# EAGLE schematic LEDTestingCircuit (EAGLE 8.3.1)
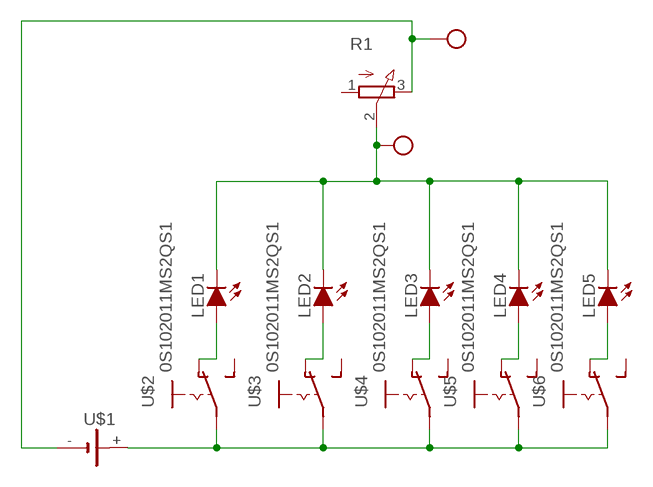
[diagram p0: schematic, sheet 1]

## Parts
LED1  LED-0805  [LED-805]
LED2  LED-0805  [LED-805]
LED3  LED-0805  [LED-805]
LED4  LED-0805  [LED-805]
LED5  LED-0805  [LED-805]
R1  3RP/1610N  [3RP/1610N]
U$1  1291-79  [1291-79]
U$2  0S102011MS2QS1  [0S102011MS2QS1]
U$3  0S102011MS2QS1  [0S102011MS2QS1]
U$4  0S102011MS2QS1  [0S102011MS2QS1]
U$5  0S102011MS2QS1  [0S102011MS2QS1]
U$6  0S102011MS2QS1  [0S102011MS2QS1]
U$7  TEST_POINT  [TEST_POINT]
U$8  TEST_POINT  [TEST_POINT]

## Nets
N$1: U$1.+ U$2.P$2(P) U$3.P$2(P) U$4.P$2(P) U$5.P$2(P) U$6.P$2(P)
N$2: LED1.A U$2.P$1(O)
N$3: LED2.A U$3.P$1(O)
N$4: LED3.A U$4.P$1(O)
N$5: LED4.A U$5.P$1(O)
N$6: LED5.A U$6.P$1(O)
N$7: LED1.C LED2.C LED3.C LED4.C LED5.C R1.2(S) U$7.P$1
N$8: R1.3(E) U$1.- U$8.P$1
Unconnected: R1.1(A) U$2.P$3(S) U$3.P$3(S) U$4.P$3(S) U$5.P$3(S) U$6.P$3(S)

## Library data of the parts
LED1-LED5 = HyTechDevices:LED: Light Emitting Diode (LED) Source: Dangerous Prototypes Eagle Library <https://github.com/DangerousPrototypes/Eagle_Part_Library>
R1 = HyTechDevices:3RP/1610N: 16mm Potentiometer one level Source: http://www.alphapotentiometers.net/html/16mm_pot_2.html
U$1 = HyTechDevices:1291-79: Keystone Electronics 9V 9 Volt battery holder 1291-79
U$2-U$6 = HyTechDevices:0S102011MS2QS1: Slide Switch 0S102011MS2QS1
U$7 U$8 = HyTechDevices:TEST_POINT: Keystone Electronics Test Point 5005